# EAGLE design tinyvom (EAGLE 5.03)
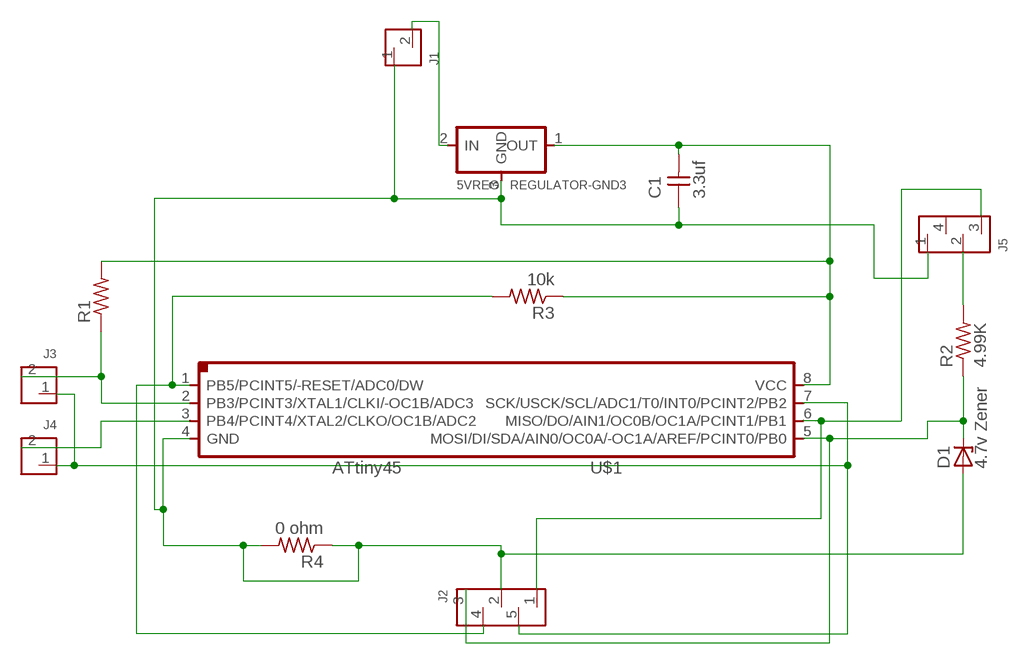
[diagram p0: schematic, sheet 1]

## Parts
5VREG  REGULATOR-GND3  [SOT-23]
C1  3.3uf  UNPOLARIZED_CAPACITOR1206  [1206]
D1  4.7v Zener  ZENER_DIODESOD123  [SOD123]
J1  MTA_2MTA_2  [MTA_2]
J2  MTA_5MTA_5  [MTA_5]
J3  MTA_2MTA_2  [MTA_2]
J4  MTA_2MTA_2  [MTA_2]
J5  MTA_4MTA_4  [MTA_4]
R1  RESISTOR1206  [1206]
R2  4.99K  RESISTOR1206  [1206]
R3  10k  RESISTOR1206  [1206]
R4  0 ohm  RESISTOR1206  [1206]
U$1  ATTINY45SI  [SOIC8]

## Nets
N$1: 5VREG.2(IN) J1.2
N$2: 5VREG.3(GND) C1.1 D1.ANODE J1.1 J2.2 J5.1 R4.1 R4.2 U$1.4(GND)
N$3: 5VREG.1(OUT) C1.2 R1.2 R3.1 U$1.8(VCC)
N$4: D1.CATHODE J2.3 R2.1 U$1.5(MOSI/DI/SDA/AIN0/OC0A/-OC1A/AREF/PCINT0/PB0)
N$5: J2.1 J5.3 U$1.6(MISO/DO/AIN1/OC0B/OC1A/PCINT1/PB1)
N$6: J4.2 U$1.3(PB4/PCINT4/XTAL2/CLKO/OC1B/ADC2)
N$8: J2.4 R3.2 U$1.1(PB5/PCINT5/-RESET/ADC0/DW)
N$10: J3.2 R1.1 U$1.2(PB3/PCINT3/XTAL1/CLKI/-OC1B/ADC3)
N$11: J5.2 R2.2
N$12: J2.5 J3.1 J4.1 U$1.7(SCK/USCK/SCL/ADC1/T0/INT0/PCINT2/PB2)
Unconnected: J5.4

## Library data of the parts
5VREG = cfd:REGULATOR-GND3
C1 = ng:UNPOLARIZED_CAPACITOR: unpolarized_capacitor
D1 = ng:ZENER_DIODE: zener diode
J1 J3 J4 = ng:MTA_2
J2 = ng:MTA_5
J5 = ng:MTA_4
R1-R4 = ng:RESISTOR
U$1 = ng:ATTINY45

## Board
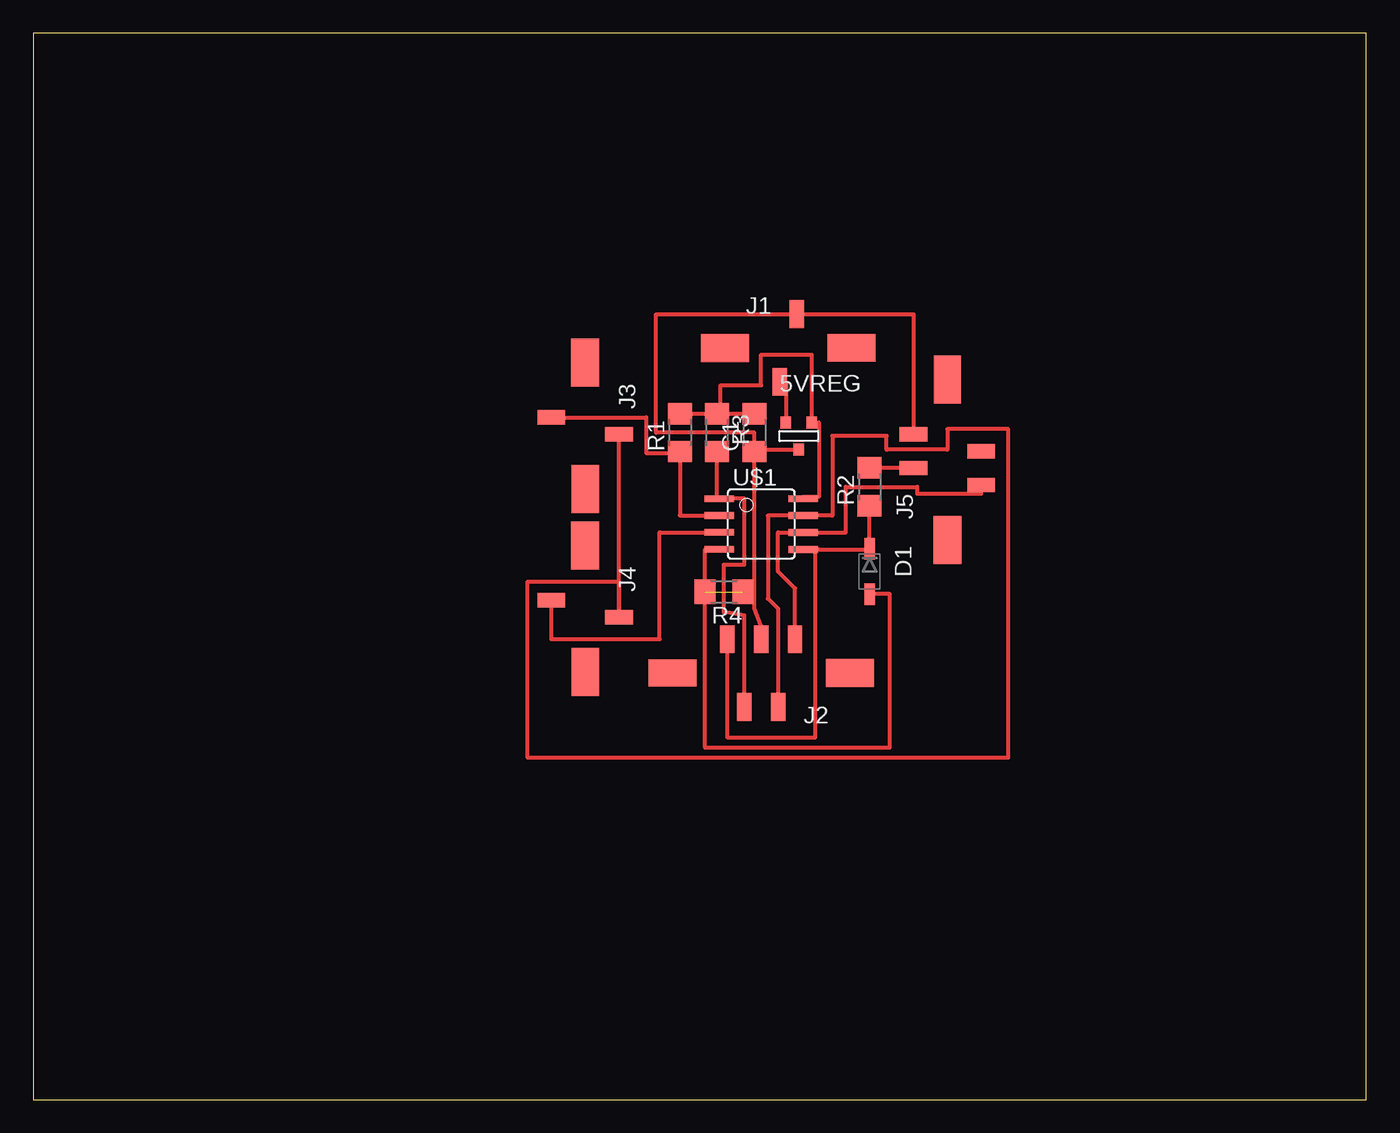
[diagram p1: board, top side]

Size 100 x 80 mm. Coordinates in mm from the lower left corner, seen from the top.
Outline: 0,0 100,0 100,80 0,80 0,0
Copper layers (1*16): Top 0.035mm / dielectric 1.5mm / Bottom 0.035mm
Design rules "default *": minimum track width 10mil, minimum drill 24mil, track to track 16mil, track to pad 16mil, pad to pad 16mil, via to via 16mil, smd to smd 8mil, copper to edge 40mil, drill to drill 8mil, minimum pad ring 10mil, minimum via ring 8mil, stop-mask expansion 4mil, vias tented up to drill 0mil, thermal gap 10mil

### Footprints (pad centres in the part's own frame; a part is rotated, then mirrored left to right if it is on the bottom)
SOT-23 = smd 0.787 x 0.889: 1 0.991,1.016; 2 -0.94,1.016; 3 0.025,-1.016
1206 = smd 1.6 x 1.803: 1 -1.422,0; 2 1.422,0
SOD123 = smd 1.6 x 0.8: ANODE 1.7,0; CATHODE -1.7,0
MTA_2 = smd 1.067 x 2.083: 1 -0.635,-2.54; 2 0.635,2.54 | smd 3.607 x 2.057: P$5 -4.75,0 | smd 3.607 x 2.083: P$6 4.75,0
MTA_5 = smd 1.067 x 2.083: 1 2.54,2.54; 2 0,2.54; 3 -2.54,2.54; 4 -1.27,-2.54; 5 1.27,-2.54 | smd 3.607 x 2.057: P$5 -6.655,0 | smd 3.607 x 2.083: P$6 6.655,0
MTA_4 = smd 1.067 x 2.083: 1 -1.905,-2.54; 2 0.635,-2.54; 3 1.905,2.54; 4 -0.635,2.54 | smd 3.607 x 2.057: P$5 -6.02,0 | smd 3.607 x 2.083: P$6 6.02,0
SOIC8 = smd 0.5 x 2.2: 1 -1.905,-3.154; 2 -0.645,-3.154; 3 0.625,-3.154; 4 1.895,-3.154; 5 1.905,3.154; 6 0.635,3.154; 7 -0.635,3.154; 8 -1.905,3.154

### Placement (x,y rotation side)
5VREG  57.4,49.78 0 top
C1  54.1,50.04 90 top
D1  62.74,39.62 270 top
J1  56.64,56.39 180 top
J2  54.61,32 0 top
J3  41.4,50.55 90 top
J4  41.4,36.83 90 top
J5  68.58,48.01 270 top
R1  48.51,50.04 90 top
R2  62.74,45.97 90 top
R3  51.31,50.04 270 top
R4  51.82,38.1 180 top
U$1  54.61,43.18 270 top

### Tracks (layer width: path | path; a pad name or v marks a point on that pad's centre or on a via)
N$1
  Top 0.305: J1.2 56.46,53.85 5VREG.2
N$2  (1 unrouted)
  Top 0.305: 5VREG.3 54.1,48.77 C1.1 | C1.1 54.1,50.04 46.74,50.04 46.74,58.93 J1.1 66.04,58.93 J5.1 | U$1.4 50.39,41.28 R4.2 50.39,26.42 64.26,26.42 64.26,37.92 D1.ANODE | J2.2 54.61,35.56 54.1,36.83 54.1,38.1 | 54.1,38.1 R4.1 | 54.1,38.1 C1.1
N$3
  Top 0.305: R1.2 R3.1 | R3.1 51.05,51.46 51.05,51.05 51.56,51.05 51.56,53.59 54.61,53.59 54.61,55.88 58.4,55.88 5VREG.1 58.93,50.8 58.93,45.21 57.76,45.21 U$1.8 | R3.1 C1.2
N$4
  Top 0.305: R2.1 D1.CATHODE 62.74,41.27 58.93,41.27 | 58.93,41.27 U$1.5 | J2.3 52.07,27.18 58.67,27.18 58.67,41.27 58.93,41.27
N$5
  Top 0.305: J2.1 57.15,38.35 55.88,39.62 55.88,42.55 U$1.6 60.96,42.55 60.96,45.97 66.29,45.97 66.29,45.47 71.12,45.47 J5.3
N$6
  Top 0.305: J4.2 38.86,34.54 46.99,34.54 46.99,42.55 U$1.3
N$8
  Top 0.305: R3.2 51.31,45.09 U$1.1 53.34,45.09 53.34,40.13 51.82,40.13 51.82,36.58 53.34,36.32 J2.4
N$10
  Top 0.305: U$1.2 48.51,43.83 48.51,48.01 | 48.51,48.01 R1.1 | J3.2 45.97,51.18 45.97,48.51 48.51,48.51 48.51,48.01
N$11
  Top 0.305: J5.2 66.04,47.4 R2.2
N$12
  Top 0.305: J3.1 J4.1 43.94,38.86 37.08,38.86 37.08,25.65 73.15,25.65 73.15,50.29 68.58,50.29 68.58,48.77 64.01,48.77 64.01,49.78 59.94,49.78 59.94,43.81 U$1.7 55.12,43.81 55.12,37.59 55.88,36.83 J2.5